# Altium project BMU_v50.PrjPcb (part 1 of 5)
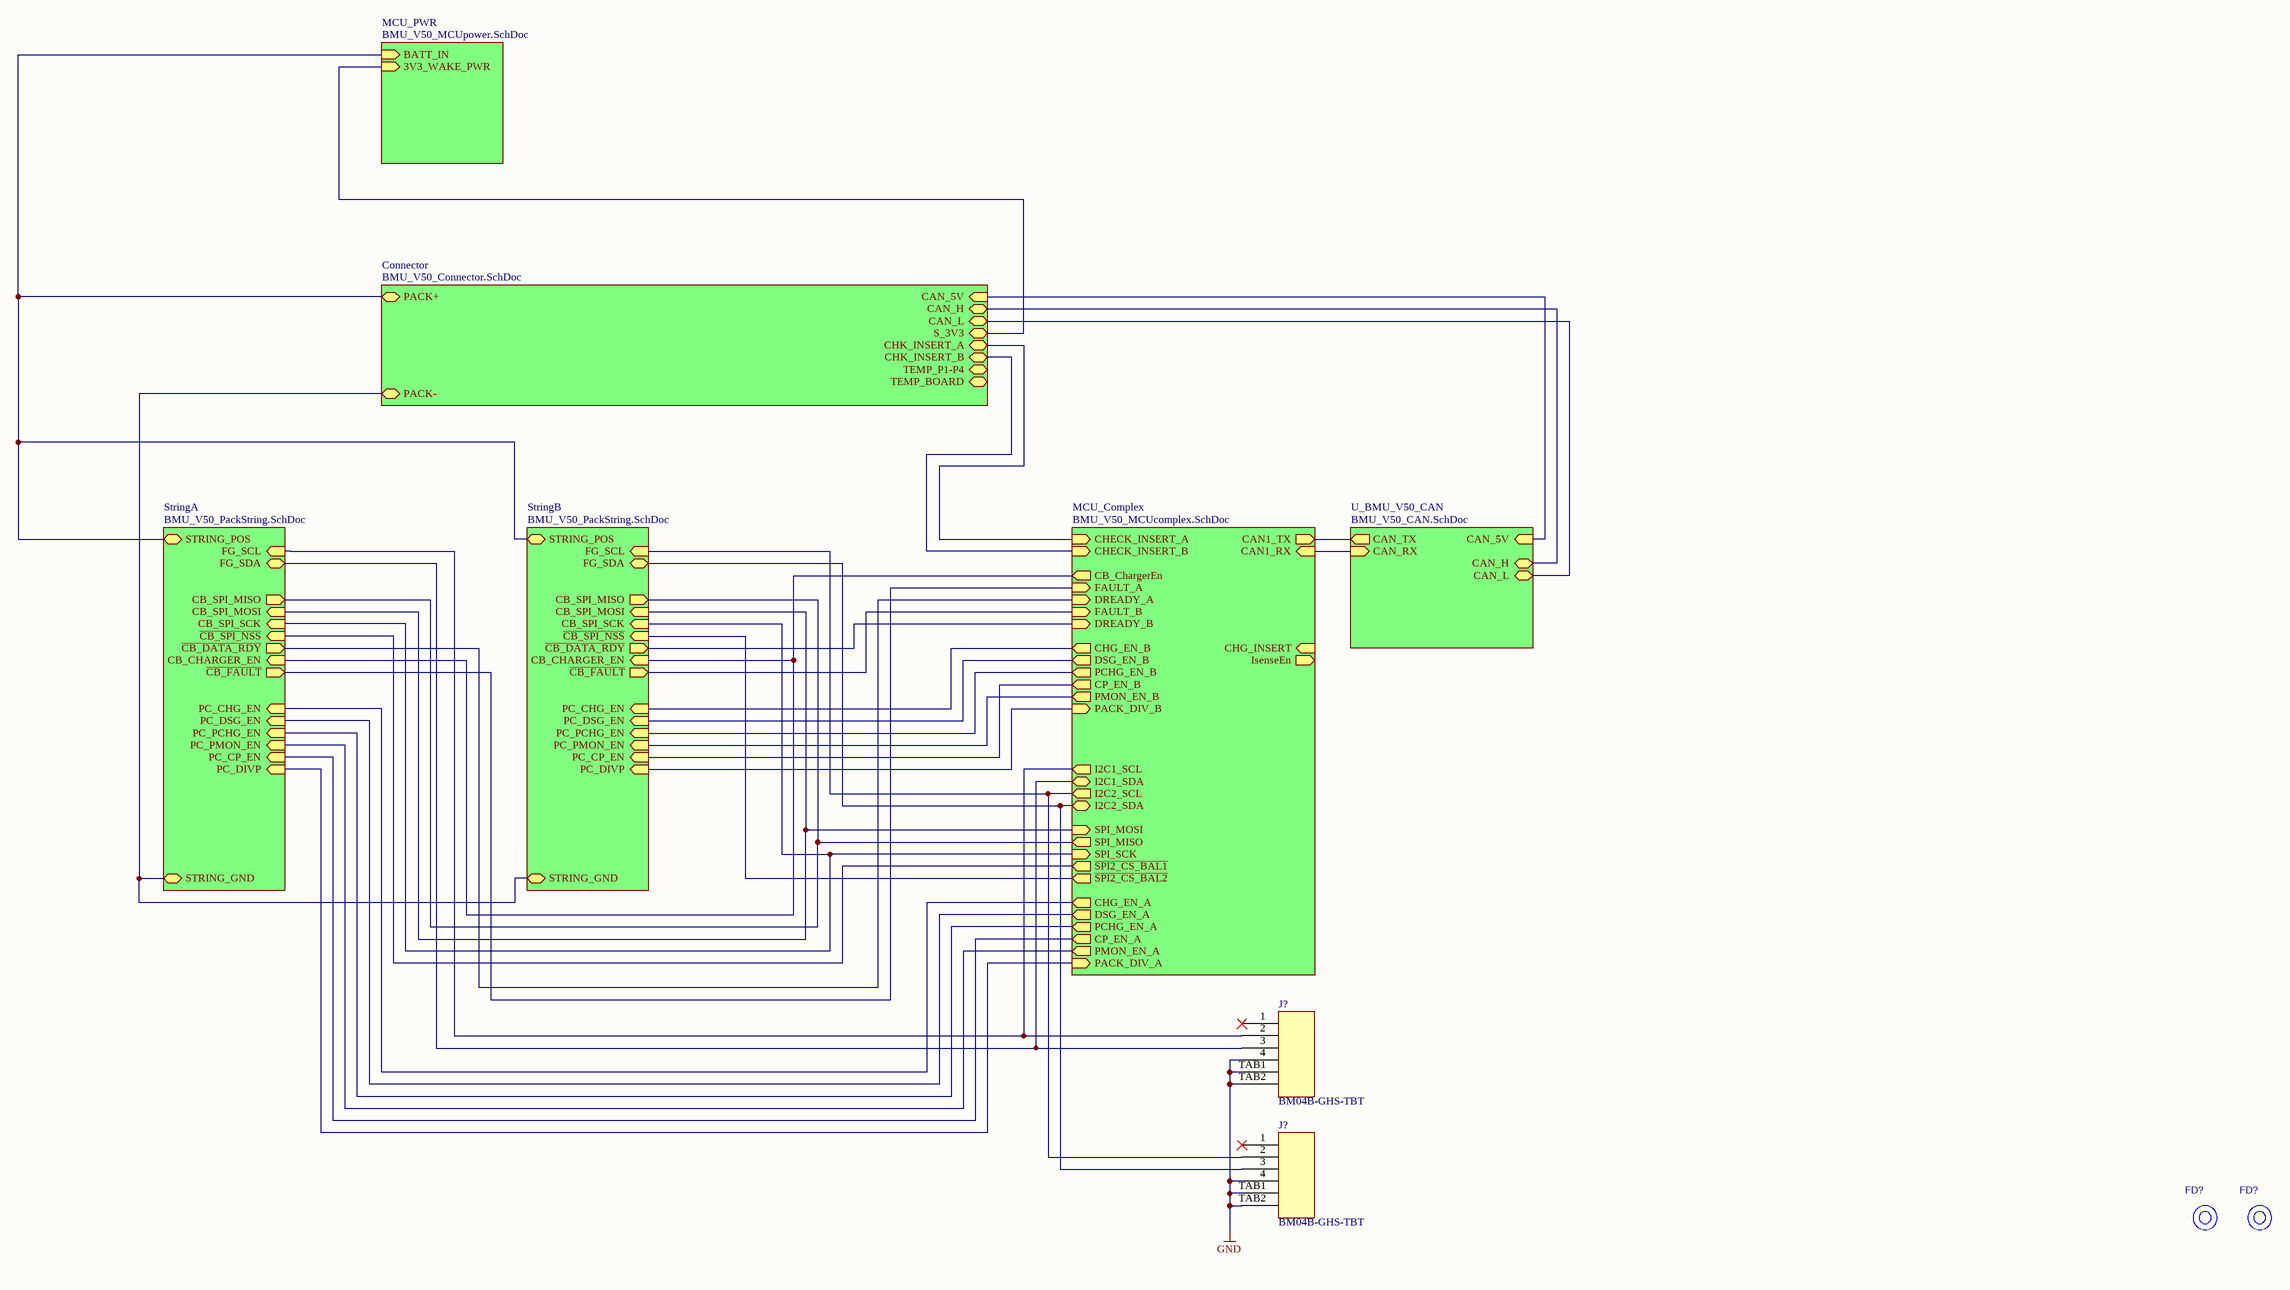
[diagram p0: BMU_V50_BlockDiagram.SchDoc]
12 sheets, 501 parts. Net scope: hierarchical (ports join the sheet entries above them; power ports are global).
Sheets:
  BMU_V50_BlockDiagram.SchDoc
    Connector = BMU_V50_Connector.SchDoc
    StringA = BMU_V50_PackString.SchDoc
      U_BMU_V50_StringFG = BMU_V50_StringFG.SchDoc
      U_BMU_V50_CellBalancer = BMU_V50_CellBalancer.SchDoc
        U_BMU_V50_CellBalanceTaps = BMU_V50_CellBalanceTaps.SchDoc
        U_BMU_V50_CellBalanceIC = BMU_V50_CellBalanceIC.SchDoc
        EXT_MEAS1 = BMU_V50_EXT_MEAS.SchDoc
        EXT_MEAS2 = BMU_V50_EXT_MEAS.SchDoc
        EXT_MEAS3 = BMU_V50_EXT_MEAS.SchDoc
        EXT_MEAS4 = BMU_V50_EXT_MEAS.SchDoc
      U_BMU_V50_StringPWRControl = BMU_V50_StringPWRControl.SchDoc
    MCU_Complex = BMU_V50_MCUcomplex.SchDoc
    MCU_PWR = BMU_V50_MCUpower.SchDoc
    U_BMU_V50_CAN = BMU_V50_CAN.SchDoc
    StringB = BMU_V50_PackString.SchDoc
      U_BMU_V50_StringFG = BMU_V50_StringFG.SchDoc
      U_BMU_V50_CellBalancer = BMU_V50_CellBalancer.SchDoc
        U_BMU_V50_CellBalanceTaps = BMU_V50_CellBalanceTaps.SchDoc
        U_BMU_V50_CellBalanceIC = BMU_V50_CellBalanceIC.SchDoc
        EXT_MEAS1 = BMU_V50_EXT_MEAS.SchDoc
        EXT_MEAS2 = BMU_V50_EXT_MEAS.SchDoc
        EXT_MEAS3 = BMU_V50_EXT_MEAS.SchDoc
        EXT_MEAS4 = BMU_V50_EXT_MEAS.SchDoc
      U_BMU_V50_StringPWRControl = BMU_V50_StringPWRControl.SchDoc

## Sheet BMU_V50_BlockDiagram.SchDoc
size C

### Parts
(Parts that share a designator on the sheet are numbered #1, #2 ... from top to bottom, then left to right.)
FD?#1  FIDUCIAL_REF  [FIDUCIAL_REFDES]  (value not drawn)  (no BOM)
FD?#2  FIDUCIAL_REF  [FIDUCIAL_REFDES]  (value not drawn)  (no BOM)
J?#1  BM04B-GHS-TBT  [BM04B-GHS-TBT]
J?#2  BM04B-GHS-TBT  [BM04B-GHS-TBT]

### Sub-sheets
Connector = BMU_V50_Connector.SchDoc: TEMP_P1-P4 (bidir), S_3V3 (bidir), CHK_INSERT_B (bidir), TEMP_BOARD (bidir), CHK_INSERT_A (bidir), PACK+ (bidir), CAN_5V (in), PACK- (bidir), CAN_H (bidir), CAN_L (bidir)
MCU_Complex = BMU_V50_MCUcomplex.SchDoc: CHG_INSERT (in), CHG_EN_A (out), ~{SPI2_CS_BAL1} (out), ~{SPI2_CS_BAL2} (out), I2C2_SCL (out), CAN1_RX (in), CAN1_TX (out), CB_ChargerEn (out), FAULT_A (in), I2C1_SDA (bidir), DREADY_A (in), SPI_SCK (in), IsenseEn (out), I2C1_SCL (out), SPI_MOSI (in), SPI_MISO (out), CHECK_INSERT_A (in), I2C2_SDA (bidir), CHECK_INSERT_B (in), FAULT_B (in), DREADY_B (in), DSG_EN_A (out), DSG_EN_B (out), CHG_EN_B (out), PACK_DIV_A (in), PACK_DIV_B (in), PMON_EN_A (out), PMON_EN_B (out), PCHG_EN_A (out), PCHG_EN_B (out), CP_EN_A (out), CP_EN_B (out)
MCU_PWR = BMU_V50_MCUpower.SchDoc: BATT_IN (in), 3V3_WAKE_PWR (in)
StringA = BMU_V50_PackString.SchDoc: FG_SDA (bidir), ~{CB_SPI_NSS} (in), ~{CB_DATA_RDY} (out), CB_CHARGER_EN (in), PC_CHG_EN (in), PC_CP_EN (in), STRING_GND (bidir), STRING_POS (bidir), FG_SCL (in), CB_SPI_MISO (out), CB_SPI_SCK (in), PC_PMON_EN (in), PC_PCHG_EN (in), PC_DSG_EN (in), CB_SPI_MOSI (in), PC_DIVP (in), ~{CB_FAULT} (out)
StringB = BMU_V50_PackString.SchDoc: FG_SDA (bidir), ~{CB_SPI_NSS} (in), ~{CB_DATA_RDY} (out), CB_CHARGER_EN (in), PC_CHG_EN (in), PC_CP_EN (in), STRING_GND (bidir), STRING_POS (bidir), FG_SCL (in), CB_SPI_MISO (out), CB_SPI_SCK (in), PC_PMON_EN (in), PC_PCHG_EN (in), PC_DSG_EN (in), CB_SPI_MOSI (in), PC_DIVP (in), ~{CB_FAULT} (out)
U_BMU_V50_CAN = BMU_V50_CAN.SchDoc: CAN_TX (out), CAN_RX (in), CAN_5V (in), CAN_H (bidir), CAN_L (bidir)

### Nets
GND: J?#1.4 J?#1.TAB1 J?#1.TAB2 J?#2.4 J?#2.TAB1 J?#2.TAB2
CAN1_RX: sheet MCU_Complex/CAN1_RX, sheet U_BMU_V50_CAN/CAN_RX
CAN1_TX: sheet MCU_Complex/CAN1_TX, sheet U_BMU_V50_CAN/CAN_TX
CAN_H: sheet Connector/CAN_H, sheet U_BMU_V50_CAN/CAN_H
CAN_L: sheet Connector/CAN_L, sheet U_BMU_V50_CAN/CAN_L
CHECK_INSERT_B: sheet Connector/CHK_INSERT_B, sheet MCU_Complex/CHECK_INSERT_B
I2C1_SCL: J?#1.2 ; sheet StringA/FG_SCL, sheet MCU_Complex/I2C1_SCL
I2C1_SDA: J?#1.3 ; sheet StringA/FG_SDA, sheet MCU_Complex/I2C1_SDA
I2C2_SCL: J?#2.2 ; sheet MCU_Complex/I2C2_SCL, sheet StringB/FG_SCL
I2C2_SDA: J?#2.3 ; sheet MCU_Complex/I2C2_SDA, sheet StringB/FG_SDA
~{SPI_CS_BAL1}: sheet StringA/~{CB_SPI_NSS}, sheet MCU_Complex/~{SPI2_CS_BAL1}
~{SPI_CS_BAL2}: sheet MCU_Complex/~{SPI2_CS_BAL2}, sheet StringB/~{CB_SPI_NSS}
SPI_MISO: sheet StringA/CB_SPI_MISO, sheet MCU_Complex/SPI_MISO, sheet StringB/CB_SPI_MISO
SPI_MOSI: sheet StringA/CB_SPI_MOSI, sheet MCU_Complex/SPI_MOSI, sheet StringB/CB_SPI_MOSI
SPI_SCK: sheet StringA/CB_SPI_SCK, sheet MCU_Complex/SPI_SCK, sheet StringB/CB_SPI_SCK
NetC?#18_1: sheet Connector/CAN_5V, sheet U_BMU_V50_CAN/CAN_5V
NetC?_StringA_U_BMU_V50_StringPWRControl#2_2: sheet Connector/PACK+, sheet StringA/STRING_POS, sheet MCU_PWR/BATT_IN, sheet StringB/STRING_POS
NetD?#4_2: sheet StringA/~{CB_FAULT}, sheet MCU_Complex/FAULT_A
NetD?#5_2: sheet MCU_Complex/FAULT_B, sheet StringB/~{CB_FAULT}
NetD?#6_2: sheet Connector/S_3V3, sheet MCU_PWR/3V3_WAKE_PWR
NetJ?#3_4: sheet Connector/CHK_INSERT_A, sheet MCU_Complex/CHECK_INSERT_A
NetJ?#3_P1: sheet Connector/PACK-, sheet StringA/STRING_GND, sheet StringB/STRING_GND
NetR?_StringA_U_BMU_V50_StringPWRControl#12_1: sheet StringA/PC_DIVP, sheet MCU_Complex/PACK_DIV_A
NetR?_StringB_U_BMU_V50_StringPWRControl#12_1: sheet MCU_Complex/PACK_DIV_B, sheet StringB/PC_DIVP
NetU?#1_8: sheet StringA/PC_DSG_EN, sheet MCU_Complex/DSG_EN_A
NetU?#1_9: sheet MCU_Complex/DSG_EN_B, sheet StringB/PC_DSG_EN
NetU?#1_10: sheet MCU_Complex/CHG_EN_B, sheet StringB/PC_CHG_EN
NetU?#1_17: sheet StringA/PC_PMON_EN, sheet MCU_Complex/PMON_EN_A
NetU?#1_24: sheet StringA/PC_CHG_EN, sheet MCU_Complex/CHG_EN_A
NetU?#1_25: sheet StringA/~{CB_DATA_RDY}, sheet MCU_Complex/DREADY_A
NetU?#1_26: sheet MCU_Complex/CP_EN_B, sheet StringB/PC_CP_EN
NetU?#1_29: sheet MCU_Complex/PCHG_EN_B, sheet StringB/PC_PCHG_EN
NetU?#1_33: sheet StringA/PC_CP_EN, sheet MCU_Complex/CP_EN_A
NetU?#1_37: sheet MCU_Complex/DREADY_B, sheet StringB/~{CB_DATA_RDY}
NetU?#1_41: sheet MCU_Complex/PMON_EN_B, sheet StringB/PC_PMON_EN
NetU?#1_50: sheet StringA/PC_PCHG_EN, sheet MCU_Complex/PCHG_EN_A
NetU?#1_55: sheet StringA/CB_CHARGER_EN, sheet MCU_Complex/CB_ChargerEn, sheet StringB/CB_CHARGER_EN

Not connected (* = marked no-connect by the designer): FD?#1 1; FD?#2 1; J?#1 1*; J?#2 1*

### Notes on the sheet
- Title
- MATTERNET
- PROPRIETRY & CONFIDENTIAL
  THE INFORMATION CONTAINS IN THIS DRAWING
  IS THE SOLE PROPERTY OF  MATTERNET Inc.
  ANY REPRODUCTION IN PART OR AS WHOLE
  WITHOUT A WRITTEN PERMISSION OF
  MATTERNET Inc. IS PROHIBITED
- Size:
- Date:
- File:
- C
- Number:
- Time:
- Revision:
- Sheet
- of
- 161 E. Evelyn Ave.
- Mountain View,
- CA 94041 USA

### Library data of the parts
FD?#1 FD?#2 = FIDUCIAL_REF: Option: AB
J?#1 J?#2 = BM04B-GHS-TBT: CONN HEADER GH TOP 4POS 1.25MM; System: Connector; ComponentLink1Description: JST GH Series Datasheet; ComponentLink1URL: http://www.jst-mfg.com/product/pdf/eng/eGH.pdf; Supplier 2: Digi-Key; Supplier Part Number 2: 455-1580-1-ND; Supplier 1: Heilind Electronics; Supplier Part Number 1: JSTBM04B-GHS-TBT(LF)(SN)N

## Sheet BMU_V50_Connector.SchDoc
size C
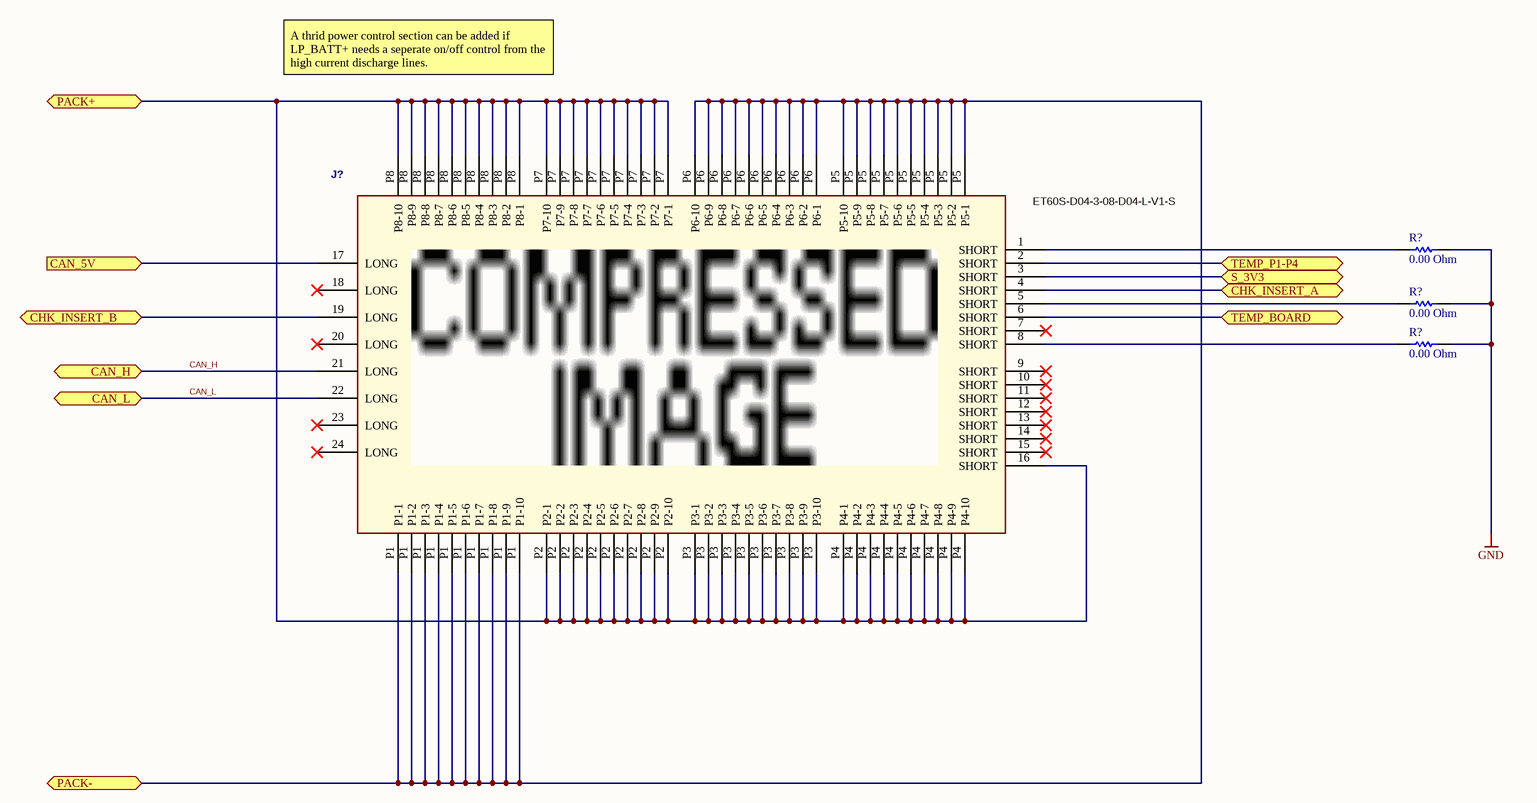
[diagram p1: BMU_V50_Connector.SchDoc]

### Parts
(Parts that share a designator on the sheet are numbered #1, #2 ... from top to bottom, then left to right.)
J?#3  ET60S-D04-3-08-D04-L-V1-S  [ET60S-D04-3-08-D04-L-V1-S]
R?#1  value 0.00 Ohm  [RESC0402(1005)_L]  (hidden comment: Jumper 0402(1005))
R?#2  value 0.00 Ohm  [RESC0402(1005)_L]  (hidden comment: Jumper 0402(1005))
R?#3  value 0.00 Ohm  [RESC0402(1005)_L]  (hidden comment: Jumper 0402(1005))

### Ports
CAN_5V (in), CAN_H (bidir), CAN_L (bidir), CHK_INSERT_A (bidir), CHK_INSERT_B (bidir), PACK+ (bidir), PACK- (bidir), S_3V3 (bidir), TEMP_BOARD (bidir), TEMP_P1-P4 (bidir)

### Nets
GND: R?#1.1 R?#2.1 R?#3.2
CAN_H: J?#3.21(LONG) ; port CAN_H
CAN_L: J?#3.22(LONG) ; port CAN_L
CHECK_INSERT_B: J?#3.19(LONG) ; port CHK_INSERT_B
NetC?#18_1: J?#3.17(LONG) ; port CAN_5V
NetC?_StringA_U_BMU_V50_StringPWRControl#2_2: J?#3.16(SHORT) J?#3.P2(P2-1) J?#3.P3(P3-1) J?#3.P4(P4-1) J?#3.P7(P7-1) J?#3.P8(P8-1) ; port PACK+
NetD?#6_2: J?#3.3(SHORT) ; port S_3V3
NetJ?#3_1: J?#3.1(SHORT) R?#1.2
NetJ?#3_2: J?#3.2(SHORT) ; port TEMP_P1-P4
NetJ?#3_4: J?#3.4(SHORT) ; port CHK_INSERT_A
NetJ?#3_5: J?#3.5(SHORT) R?#2.2
NetJ?#3_6: J?#3.6(SHORT) ; port TEMP_BOARD
NetJ?#3_8: J?#3.8(SHORT) R?#3.1
NetJ?#3_P1: J?#3.P1(P1-1) J?#3.P5(P5-1) J?#3.P6(P6-1) ; port PACK-

Not connected (* = marked no-connect by the designer): J?#3 7(SHORT)* 9(SHORT)* 10(SHORT)* 11(SHORT)* 12(SHORT)* 13(SHORT)* 14(SHORT)* 15(SHORT)* 18(LONG)* 20(LONG)* 23(LONG)* 24(LONG)*

### Notes on the sheet
- A thrid power control section can be added if LP_BATT+ needs a seperate on/off control from the high current discharge lines.
- Title
- MATTERNET
- PROPRIETRY & CONFIDENTIAL
  THE INFORMATION CONTAINS IN THIS DRAWING
  IS THE SOLE PROPERTY OF  MATTERNET Inc.
  ANY REPRODUCTION IN PART OR AS WHOLE
  WITHOUT A WRITTEN PERMISSION OF
  MATTERNET Inc. IS PROHIBITED
- Size:
- Date:
- File:
- C
- Number:
- Time:
- Revision:
- Sheet
- of
- 161 E. Evelyn Ave.
- Mountain View,
- CA 94041 USA

### Library data of the parts
J?#3 = ET60S-D04-3-08-D04-L-V1-S: EXtreme Ten60 Power Connector; custinv: Samtec; custprt: ET60S-D04-3-08-D04-L-V1-S; Supplier 1: Mouser; Supplier Part Number 1: 200-60SD04308D04LV1S; Manufacturer: Samtec; Manufacturer Part Number: ET60S-D04-3-08-D04-L-V1-S; Stock 1: 0; Pricing 1: 1=7.94, 10=7.35, 50=6.59, 100=6.15, 1000=4.96, 10000=4.96 (USD); Supplier 2: Farnell; Supplier Part Number 2: 2731048; Stock 2: 0
R?#1-R?#3 = CMP-1011-00001-1: Jumper 0402 (1005 Metric); Tolerance: None; Case-Metric: 1005; Case-EIA: 0402; Power: None; Technology: SMT

## Sheet BMU_V50_PackString.SchDoc
size C
Used 2 times, as channels StringA, StringB. Parts and nets are listed once, with the designators drawn on the sheet.
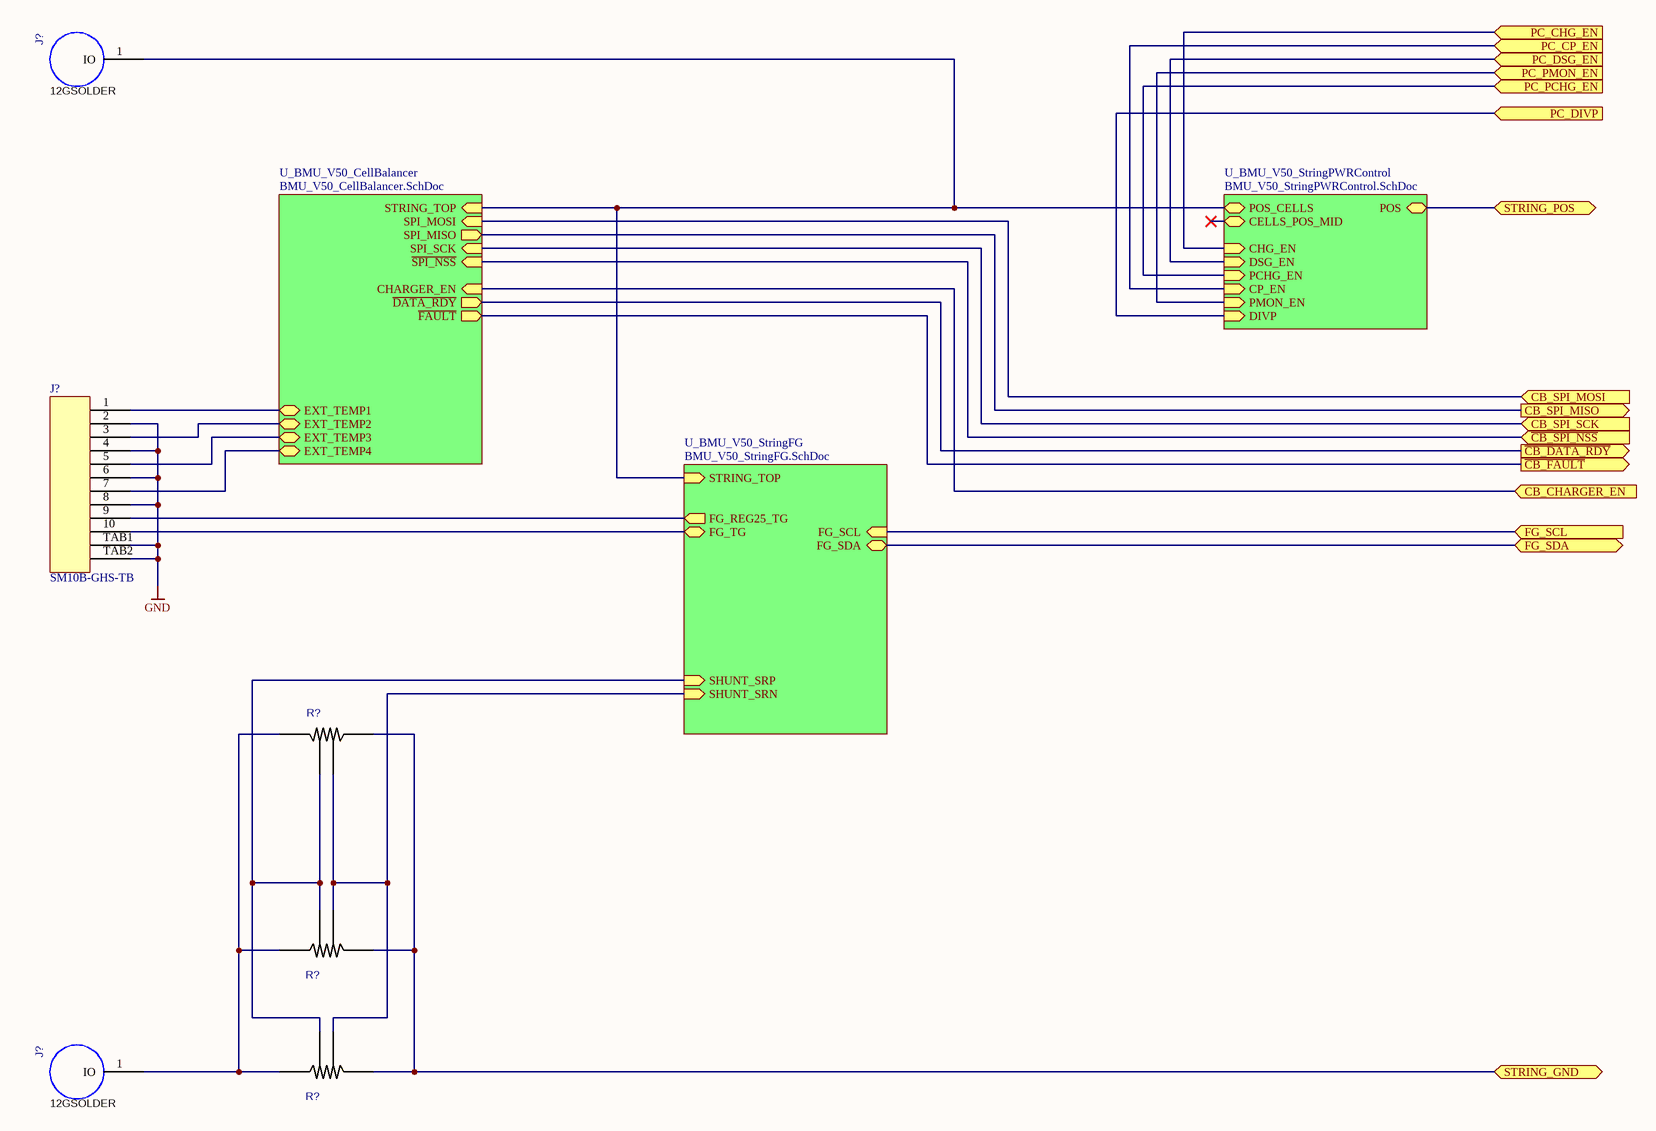
[diagram p2: BMU_V50_PackString.SchDoc]

### Parts
(Parts that share a designator on the sheet are numbered #1, #2 ... from top to bottom, then left to right.)
J?#1  12GSOLDER  [12GPAD]  (no BOM)
J?#2  SM10B-GHS-TB  [SM10B-GHS-TB]
J?#3  12GSOLDER  [12GPAD]  (no BOM)
R?#1  WSL59313L000FEA  [R5931]  (value not drawn)
R?#2  WSL59313L000FEA  [R5931]  (value not drawn)
R?#3  WSL59313L000FEA  [R5931]  (value not drawn)

### Sub-sheets
U_BMU_V50_CellBalancer = BMU_V50_CellBalancer.SchDoc: SPI_SCK (in), ~{SPI_NSS} (in), CHARGER_EN (in), SPI_MISO (out), ~{DATA_RDY} (out), ~{FAULT} (out), SPI_MOSI (in), STRING_TOP (in), EXT_TEMP4 (bidir), EXT_TEMP1 (bidir), EXT_TEMP2 (bidir), EXT_TEMP3 (bidir)
U_BMU_V50_StringFG = BMU_V50_StringFG.SchDoc: STRING_TOP (in), FG_REG25_TG (out), FG_SCL (in), FG_SDA (bidir), SHUNT_SRP (in), SHUNT_SRN (in), FG_TG (bidir)
U_BMU_V50_StringPWRControl = BMU_V50_StringPWRControl.SchDoc: DSG_EN (in), CP_EN (in), POS_CELLS (bidir), POS (bidir), CELLS_POS_MID (bidir), PCHG_EN (in), PMON_EN (in), DIVP (in), CHG_EN (in)

### Ports
CB_CHARGER_EN (in), CB_SPI_MISO (out), CB_SPI_MOSI (in), CB_SPI_SCK (in), FG_SCL (in), FG_SDA (bidir), PC_CHG_EN (in), PC_CP_EN (in), PC_DIVP (in), PC_DSG_EN (in), PC_PCHG_EN (in), PC_PMON_EN (in), STRING_GND (bidir), STRING_POS (bidir), ~{CB_DATA_RDY} (out), ~{CB_FAULT} (out), ~{CB_SPI_NSS} (in)

### Nets
GND: J?#2.2 J?#2.4 J?#2.6 J?#2.8 J?#2.TAB1 J?#2.TAB2
~{CB_DATA_RDY}: port ~{CB_DATA_RDY}, sheet U_BMU_V50_CellBalancer/~{DATA_RDY}
~{CB_FAULT}: port ~{CB_FAULT}, sheet U_BMU_V50_CellBalancer/~{FAULT}
~{CB_SPI_NSS}: port ~{CB_SPI_NSS}, sheet U_BMU_V50_CellBalancer/~{SPI_NSS}
CB_CHARGER_EN: port CB_CHARGER_EN, sheet U_BMU_V50_CellBalancer/CHARGER_EN
CB_SPI_MISO: port CB_SPI_MISO, sheet U_BMU_V50_CellBalancer/SPI_MISO
CB_SPI_MOSI: port CB_SPI_MOSI, sheet U_BMU_V50_CellBalancer/SPI_MOSI
CB_SPI_SCK: port CB_SPI_SCK, sheet U_BMU_V50_CellBalancer/SPI_SCK
FG_SCL: port FG_SCL, sheet U_BMU_V50_StringFG/FG_SCL
FG_SDA: port FG_SDA, sheet U_BMU_V50_StringFG/FG_SDA
PC_CHG_EN: port PC_CHG_EN, sheet U_BMU_V50_StringPWRControl/CHG_EN
PC_CP_EN: port PC_CP_EN, sheet U_BMU_V50_StringPWRControl/CP_EN
PC_DIVP: port PC_DIVP, sheet U_BMU_V50_StringPWRControl/DIVP
PC_DSG_EN: port PC_DSG_EN, sheet U_BMU_V50_StringPWRControl/DSG_EN
PC_PCHG_EN: port PC_PCHG_EN, sheet U_BMU_V50_StringPWRControl/PCHG_EN
PC_PMON_EN: port PC_PMON_EN, sheet U_BMU_V50_StringPWRControl/PMON_EN
STRING_GND: R?#1.2 R?#2.1 R?#3.1 ; port STRING_GND
STRING_POS: port STRING_POS, sheet U_BMU_V50_StringPWRControl/POS
NetJ?#1_1: J?#1.1(IO) ; sheet U_BMU_V50_StringFG/STRING_TOP, sheet U_BMU_V50_CellBalancer/STRING_TOP, sheet U_BMU_V50_StringPWRControl/POS_CELLS
NetJ?#2_1: J?#2.1 ; sheet U_BMU_V50_CellBalancer/EXT_TEMP1
NetJ?#2_3: J?#2.3 ; sheet U_BMU_V50_CellBalancer/EXT_TEMP2
NetJ?#2_5: J?#2.5 ; sheet U_BMU_V50_CellBalancer/EXT_TEMP3
NetJ?#2_7: J?#2.7 ; sheet U_BMU_V50_CellBalancer/EXT_TEMP4
NetJ?#2_9: J?#2.9 ; sheet U_BMU_V50_StringFG/FG_REG25_TG
NetJ?#2_10: J?#2.10 ; sheet U_BMU_V50_StringFG/FG_TG
NetJ?#3_1: J?#3.1(IO) R?#1.1 R?#2.2 R?#3.2
NetR?#1_3: R?#1.3 R?#2.4 R?#3.4 ; sheet U_BMU_V50_StringFG/SHUNT_SRP
NetR?#1_4: R?#1.4 R?#2.3 R?#3.3 ; sheet U_BMU_V50_StringFG/SHUNT_SRN

### Channels
StringA: designators J?=J?_StringA#3 J?=J?_StringA#1 J?=J?_StringA#2 R?=R?_StringA#2 R?=R?_StringA#1 R?=R?_StringA#3; ports CB_CHARGER_EN=NetU?#1_55 CB_SPI_MISO=SPI_MISO CB_SPI_MOSI=SPI_MOSI CB_SPI_SCK=SPI_SCK FG_SCL=I2C1_SCL FG_SDA=I2C1_SDA PC_CHG_EN=NetU?#1_24 PC_CP_EN=NetU?#1_33 PC_DIVP=NetR?_StringA_U_BMU_V50_StringPWRControl#12_1 PC_DSG_EN=NetU?#1_8 PC_PCHG_EN=NetU?#1_50 PC_PMON_EN=NetU?#1_17 STRING_GND=NetJ?#3_P1 STRING_POS=NetC?_StringA_U_BMU_V50_StringPWRControl#2_2 ~{CB_DATA_RDY}=NetU?#1_25 ~{CB_FAULT}=NetD?#4_2 ~{CB_SPI_NSS}=~{SPI_CS_BAL1}
StringB: designators J?=J?_StringB#3 J?=J?_StringB#1 J?=J?_StringB#2 R?=R?_StringB#2 R?=R?_StringB#1 R?=R?_StringB#3; ports CB_CHARGER_EN=NetU?#1_55 CB_SPI_MISO=SPI_MISO CB_SPI_MOSI=SPI_MOSI CB_SPI_SCK=SPI_SCK FG_SCL=I2C2_SCL FG_SDA=I2C2_SDA PC_CHG_EN=NetU?#1_10 PC_CP_EN=NetU?#1_26 PC_DIVP=NetR?_StringB_U_BMU_V50_StringPWRControl#12_1 PC_DSG_EN=NetU?#1_9 PC_PCHG_EN=NetU?#1_29 PC_PMON_EN=NetU?#1_41 STRING_GND=NetJ?#3_P1 STRING_POS=NetC?_StringA_U_BMU_V50_StringPWRControl#2_2 ~{CB_DATA_RDY}=NetU?#1_37 ~{CB_FAULT}=NetD?#5_2 ~{CB_SPI_NSS}=~{SPI_CS_BAL2}

### Notes on the sheet
- Title
- MATTERNET
- PROPRIETRY & CONFIDENTIAL
  THE INFORMATION CONTAINS IN THIS DRAWING
  IS THE SOLE PROPERTY OF  MATTERNET Inc.
  ANY REPRODUCTION IN PART OR AS WHOLE
  WITHOUT A WRITTEN PERMISSION OF
  MATTERNET Inc. IS PROHIBITED
- Size:
- Date:
- File:
- C
- Number:
- Time:
- Revision:
- Sheet
- of
- 161 E. Evelyn Ave.
- Mountain View,
- CA 94041 USA

### Library data of the parts
J?#1 J?#3 = 12GSOLDER: Option: AB
J?#2 = SM10B-GHS-TB: CONN HEADER GH SIDE 10POS 1.25MM; System: Connector; ComponentLink1Description: JST GH Series Datasheet; ComponentLink1URL: http://www.jst-mfg.com/product/pdf/eng/eGH.pdf; Supplier 1: Digi-Key; Supplier Part Number 1: 455-1572-1-ND
R?#1-R?#3 = Res_4Term: RES SMD 3 MOHM 1% 5W 5931; Manufacturer 1: Vishay Dale; Resistance: 3mR; Temperature Coefficient: 75ppm/°C; Supplier 1: Digi-Key; Supplier Part Number 1: WSLN-.003CT-ND; Manufacturer Part Number 1: WSL59313L000FEA; RoHS: Yes; Category: Chip SMD Resistors; Stock 1: 2078; Pricing 1: 1=2.28000, 10=2.02300, 25=1.87600, 50=1.76560, 100=1.54490, 250=1.32424, 500=1.10354 (USD); Case/Package: 5931; Case Code (Imperial): 5931; Min Operating Temperature: -65°C; Max Operating Temperature: 170°C; Composition: Metal Element,Metal Strip; Number of Terminations: 2; Termination: SMD/SMT; Features: Moisture Resistant; Package Quantity: 1; Power Rating: 5W; Tolerance: 1%; Packaging: Tape and Reel; Max Power Dissipation: 5W; Length: 0.591inch; Height: 0.02inch; Width: 0.305inch
  R?#1: ComponentLink1URL: https://datasheet.ciiva.com/2484/wsl3921-2484790.pdf?src-supplier=Digi-Key; ComponentLink1Description: https://datasheet.ciiva.com/2484/wsl3921-2484790.pdf?src-supplier=Digi-Key; ComponentLink2URL: https://datasheet.ciiva.com/2484/wsl3921-2484791.pdf?src-supplier=Digi-Key; ComponentLink2Description: https://datasheet.ciiva.com/2484/wsl3921-2484791.pdf?src-supplier=Digi-Key; ComponentLink3URL: https://datasheet.ciiva.com/2484/wsl3921-2484792.pdf?src-supplier=Digi-Key; ComponentLink3Description: https://datasheet.ciiva.com/2484/wsl3921-2484792.pdf?src-supplier=Digi-Key
  R?#2 R?#3: ComponentLink1URL: http://www.farnell.com/datasheets/1678796.pdf; ComponentLink1Description: http://www.farnell.com/datasheets/1678796.pdf; ComponentLink2URL: http://industrial.panasonic.com/www-data/pdf/AOA0000/AOA0000CE1.pdf; ComponentLink2Description: http://industrial.panasonic.com/www-data/pdf/AOA0000/AOA0000CE1.pdf; ComponentLink3URL: http://www.mouser.com/ds/2/315/AOA0000C84-947596.pdf; ComponentLink3Description: http://www.mouser.com/ds/2/315/AOA0000C84-947596.pdf; ComponentLink4URL: https://www.alliedelec.com/m/d/51cd0790071e1666bdb9d00c57fcf960.pdf; ComponentLink4Description: https://www.alliedelec.com/m/d/51cd0790071e1666bdb9d00c57fcf960.pdf; ComponentLink5URL: http://www.vishay.com/docs/30110/wsl3921.pdf; ComponentLink5Description: http://www.vishay.com/docs/30110/wsl3921.pdf; ComponentLink6URL: https://datasheet.ciiva.com/2484/wsl3921-2484790.pdf?src-supplier=Digi-Key; ComponentLink6Description: https://datasheet.ciiva.com/2484/wsl3921-2484790.pdf?src-supplier=Digi-Key; ComponentLink7URL: https://datasheet.ciiva.com/2484/wsl3921-2484791.pdf?src-supplier=Digi-Key; ComponentLink7Description: https://datasheet.ciiva.com/2484/wsl3921-2484791.pdf?src-supplier=Digi-Key; ComponentLink8URL: https://datasheet.ciiva.com/2484/wsl3921-2484792.pdf?src-supplier=Digi-Key; ComponentLink8Description: https://datasheet.ciiva.com/2484/wsl3921-2484792.pdf?src-supplier=Digi-Key

## Sheet BMU_V50_StringFG.SchDoc
size C
Used 2 times, as channels StringA/U_BMU_V50_StringFG, StringB/U_BMU_V50_StringFG. Parts and nets are listed once, with the designators drawn on the sheet.
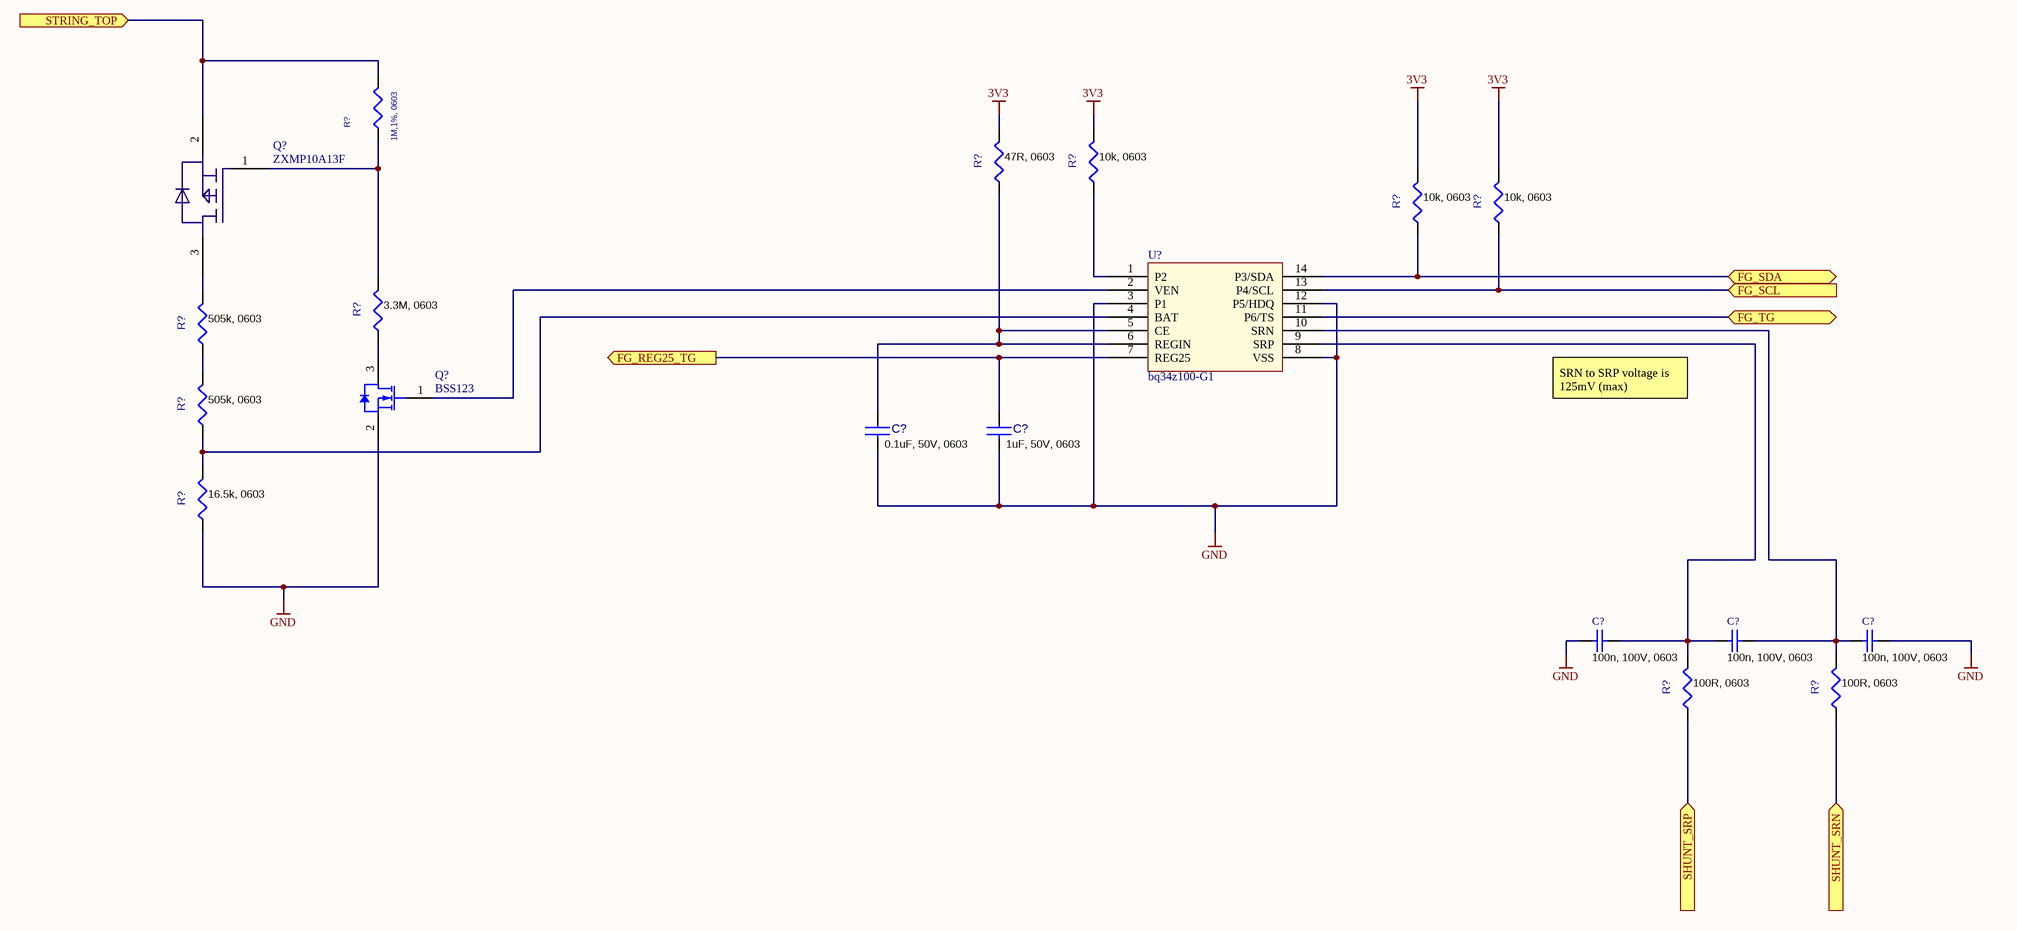
[diagram p3: BMU_V50_StringFG.SchDoc]

### Parts
(Parts that share a designator on the sheet are numbered #1, #2 ... from top to bottom, then left to right.)
C?#1  0.1uF, 50V, 0603  [C0603]
C?#2  1uF, 50V, 0603  [C0603]
C?#3  100n, 100V, 0603  [C0603]
C?#4  100n, 100V, 0603  [C0603]
C?#5  100n, 100V, 0603  [C0603]
Q?#1  ZXMP10A13F  [SOT90P240X110-3N - ZXMP10A13F]
Q?#2  BSS123  [FAIR-SOT23-3_V]
R?#1  1M,1%, 0603  [R0603]
R?#2  47R, 0603  [R0603]
R?#3  10k, 0603  [R0603]
R?#4  10k, 0603  [R0603]
R?#5  10k, 0603  [R0603]
R?#6  3.3M, 0603  [R0603]
R?#7  505k, 0603  [R0603]
R?#8  505k, 0603  [R0603]
R?#9  16.5k, 0603  [R0603]
R?#10  100R, 0603  [R0603]
R?#11  100R, 0603  [R0603]
U?  bq34z100-G1  [PW14]

### Ports
FG_REG25_TG (out), FG_SCL (in), FG_SDA (bidir), FG_TG (bidir), SHUNT_SRN (in), SHUNT_SRP (in), STRING_TOP (in)

### Nets
3V3: R?#2.2 R?#3.2 R?#4.2 R?#5.2
GND: C?#1.2 C?#2.2 C?#3.2 C?#5.1 Q?#2.2(S) R?#9.1 U?.3(P1) U?.8(VSS) U?.12(P5/HDQ)
FG_REG25_TG: C?#2.1 U?.7(REG25) ; port FG_REG25_TG
FG_SCL: R?#5.1 U?.13(P4/SCL) ; port FG_SCL
FG_SDA: R?#4.1 U?.14(P3/SDA) ; port FG_SDA
FG_TG: U?.11(P6/TS) ; port FG_TG
SHUNT_SRN: R?#11.1 ; port SHUNT_SRN
SHUNT_SRP: R?#10.1 ; port SHUNT_SRP
STRING_TOP: Q?#1.2(S) R?#1.2 ; port STRING_TOP
NetC?#1_1: C?#1.1 R?#2.1 U?.5(CE) U?.6(REGIN)
NetC?#3_1: C?#3.1 C?#4.2 R?#10.2 U?.9(SRP)
NetC?#4_1: C?#4.1 C?#5.2 R?#11.2 U?.10(SRN)
NetQ?#1_1: Q?#1.1(G) R?#1.1 R?#6.2
NetQ?#1_3: Q?#1.3(D) R?#7.2
NetQ?#2_1: Q?#2.1(G) U?.2(VEN)
NetQ?#2_3: Q?#2.3(D) R?#6.1
NetR?#3_1: R?#3.1 U?.1(P2)
NetR?#7_1: R?#7.1 R?#8.2
NetR?#8_1: R?#8.1 R?#9.2 U?.4(BAT)

### Channels
StringA/U_BMU_V50_StringFG: designators C?=C?_StringA_U_BMU_V50_StringFG#1 C?=C?_StringA_U_BMU_V50_StringFG#2 C?=C?_StringA_U_BMU_V50_StringFG#3 C?=C?_StringA_U_BMU_V50_StringFG#4 C?=C?_StringA_U_BMU_V50_StringFG#5 Q?=Q?_StringA_U_BMU_V50_StringFG#1 Q?=Q?_StringA_U_BMU_V50_StringFG#2 R?=R?_StringA_U_BMU_V50_StringFG#3 R?=R?_StringA_U_BMU_V50_StringFG#2 R?=R?_StringA_U_BMU_V50_StringFG#1 R?=R?_StringA_U_BMU_V50_StringFG#8 R?=R?_StringA_U_BMU_V50_StringFG#9 R?=R?_StringA_U_BMU_V50_StringFG#7 R?=R?_StringA_U_BMU_V50_StringFG#6 R?=R?_StringA_U_BMU_V50_StringFG#4 R?=R?_StringA_U_BMU_V50_StringFG#5 R?=R?_StringA_U_BMU_V50_StringFG#10 R?=R?_StringA_U_BMU_V50_StringFG#11 U?=U?_StringA_U_BMU_V50_StringFG; ports FG_REG25_TG=NetC?_StringA_U_BMU_V50_StringFG#2_1 FG_SCL=I2C1_SCL FG_SDA=I2C1_SDA FG_TG=NetJ?_StringA#2_10 SHUNT_SRN=NetR?_StringA#1_4 SHUNT_SRP=NetR?_StringA#1_3 STRING_TOP=NetC?_StringA_U_BMU_V50_StringPWRControl#1_1
StringB/U_BMU_V50_StringFG: designators C?=C?_StringB_U_BMU_V50_StringFG#1 C?=C?_StringB_U_BMU_V50_StringFG#2 C?=C?_StringB_U_BMU_V50_StringFG#3 C?=C?_StringB_U_BMU_V50_StringFG#4 C?=C?_StringB_U_BMU_V50_StringFG#5 Q?=Q?_StringB_U_BMU_V50_StringFG#1 Q?=Q?_StringB_U_BMU_V50_StringFG#2 R?=R?_StringB_U_BMU_V50_StringFG#3 R?=R?_StringB_U_BMU_V50_StringFG#2 R?=R?_StringB_U_BMU_V50_StringFG#1 R?=R?_StringB_U_BMU_V50_StringFG#8 R?=R?_StringB_U_BMU_V50_StringFG#9 R?=R?_StringB_U_BMU_V50_StringFG#7 R?=R?_StringB_U_BMU_V50_StringFG#6 R?=R?_StringB_U_BMU_V50_StringFG#4 R?=R?_StringB_U_BMU_V50_StringFG#5 R?=R?_StringB_U_BMU_V50_StringFG#10 R?=R?_StringB_U_BMU_V50_StringFG#11 U?=U?_StringB_U_BMU_V50_StringFG; ports FG_REG25_TG=NetC?_StringB_U_BMU_V50_StringFG#2_1 FG_SCL=I2C2_SCL FG_SDA=I2C2_SDA FG_TG=NetJ?_StringB#2_10 SHUNT_SRN=NetR?_StringB#1_4 SHUNT_SRP=NetR?_StringB#1_3 STRING_TOP=NetC?_StringB_U_BMU_V50_StringPWRControl#1_1

### Notes on the sheet
- SRN to SRP voltage is 125mV (max)
- Title
- MATTERNET
- PROPRIETRY & CONFIDENTIAL
  THE INFORMATION CONTAINS IN THIS DRAWING
  IS THE SOLE PROPERTY OF  MATTERNET Inc.
  ANY REPRODUCTION IN PART OR AS WHOLE
  WITHOUT A WRITTEN PERMISSION OF
  MATTERNET Inc. IS PROHIBITED
- Size:
- Date:
- File:
- C
- Number:
- Time:
- Revision:
- Sheet
- of
- 161 E. Evelyn Ave.
- Mountain View,
- CA 94041 USA

### Library data of the parts
C?#1 = CAP-Generic-0603: CAP CER 0.1UF 50V 10% X7R 0603; Manufacturer: Murata; Manufacturer Part Number: GCJ188R71E104KA12D; Supplier 1: Digi-Key; Supplier Part Number 1: 490-16477-1-ND; Stock 1: 2560; Pricing 1: 1=0.22, 10=0.152, 100=0.077, 500=0.0527, 1000=0.04662 (USD); Case/Package: 0603; Supplier 2: Mouser; Supplier Part Number 2: 81-GCJ188R71E104KA2D; Stock 2: 47905; Pricing 2: 1=0.21, 10=0.139, 50=0.139, 100=0.071, 1000=0.043, 10000=0.035 (USD)
C?#2 = CAP-Generic-0603: CAP CER 1UF 50V 10% X7R 0603
C?#3-C?#5 = Cap: CAP CER 100n 100V X7R 0603; Manufacturer: Murata; Manufacturer Part Number: GCJ188R72A104KA01D; Capacitance: 100nF; Tolerance: 10%; Supplier 1: Digi-Key; Supplier Part Number 1: 490-13420-1-ND; Stock 1: 224293; Pricing 1: 1=0.28, 10=0.189, 100=0.1073, 500=0.07578, 1000=0.0663 (USD); Mount: Surface Mount; Case/Package: 0603; Case Code (Metric): 1608; Case Code (Imperial): 0603; Min Operating Temperature: -55°C; Max Operating Temperature: 125°C; Packaging: Tape and Reel; Voltage Rating: 100V; Features: Soft Termination; Length: 0.063inch; Width: 0.031inch; Thickness: 0.035inch; Ratings: AEC-Q200; Lead Free: Lead Free; Supplier 2: Mouser; Supplier Part Number 2: 81-GCJ188R72A104KA1D; Stock 2: 680575; Pricing 2: 1=0.26, 10=0.173, 50=0.173, 100=0.099, 1000=0.061, 10000=0.05 (USD)
Q?#1 = ZXMP10A13F: 100V P-CHANNEL ENHANCEMENT MODE MOSFET; Supplier 1: Digi-Key; ComponentLink1Description: Datasheet; ComponentLink1URL: https://www.diodes.com/assets/Datasheets/ZXMP10A13F.pdf; Supplier Part Number 1: ZXMP10A13FCT-ND
Q?#2 = CMP-2000-04934-1: N-Channel Logic Level Enhancement Mode Field Effect Transistor, 1.7 V, -55 to 150 degC, 3-Pin SOT-23, RoHS, Tape and Reel; Manufacturer: Fairchild; Channel Type: N; Typical Turn-Off Delay Time: 17ns; Maximum Continuous Drain Current: 0.17A; Rad Hard: No; Typical Rise Time: 9ns; Typical Fall Time: 2.4ns; Maximum Gate Source Voltage: ±20V; Maximum Drain Source Voltage: 100V; Typical Turn-On Delay Time: 1.7ns; RDS-on: 6000@10VmOhm; Package Version: Rev. 12, 03/2016; Packaging: Tape&Reel; Package Reference: SOT23-3; Channel Mode: Enhancement; Operating Temperature: -55to150degC; Package Description: 3-Pin Small Outline Transistor, Body 2.92 x 1.325 mm, Pitch 0.95 mm; Category: MOSFET; Datasheet Version: Jun-03; Datasheet URL: https://www.fairchildsemi.com/datasheets/BS/BSS123.pdf; Manufacturer URL: https://www.fairchildsemi.com/; Mounting: SurfaceMount; Package: 3SOT-23; Package URL: http://www.fairchildsemi.com/dwg/MA/MA03D.pdf
R?#1 = R-Generic-0603: custprt: 100-0110-000153; custinv: Ansync; Option: AB
R?#2 = R-Generic-0603: RES SMD 47R OHM 1% 1/10W 0603
R?#3-R?#5 = R-Generic-0603: RES SMD 10k OHM 1% 1/10W 0603
R?#6 = R-Generic-0603: RES SMD 3.3M OHM 1% 1/10W 0603
R?#7 R?#8 = R-Generic-0603: RES SMD 505k OHM 1% 1/10W 0603
R?#9 = R-Generic-0603: RES SMD 16.5k OHM 1% 1/10W 0603
R?#10 R?#11 = R-Generic-0603: RES SMD 100R OHM 1% 1/10W 0603
U? = bq34z100-G1: Wide Range Fuel Gauge with Impedance Track™ Technology; Manufacturer 1: Texas Instruments; Manufacturer Part Number 1: BQ34Z100PWR-G1; Operating Supply Voltage: 4.5V; Interface: I2C; Supplier 1: Digi-Key; RoHS: Yes; Category: Battery Management; Stock 1: 18187; Pricing 1: 1=4.08000, 10=3.66500, 25=3.46520, 100=2.84900, 250=2.55640, 500=2.46400, 1000=2.04820 (USD); Mount: Surface Mount; Case/Package: TSSOP; Number of Pins: 14; Weight: 0.004949oz; Contact Plating: Gold; Min Operating Temperature: -40°C; Max Operating Temperature: 85°C; Package Quantity: 2000; Packaging: Tape and Reel; Lead Free: Lead Free; ComponentLink1URL: http://www.ti.com/lit/ds/symlink/bq34z100-g1.pdf?src-supplier=Digi-Key; ComponentLink1Description: http://www.ti.com/lit/ds/symlink/bq34z100-g1.pdf?src-supplier=Digi-Key; ComponentLink2URL: http://www.ti.com/general/docs/lit/getliterature.tsp?genericPartNumber=BQ34Z100-G1&&fileType=pdf&src-supplier=Avnet; ComponentLink2Description: http://www.ti.com/general/docs/lit/getliterature.tsp?genericPartNumber=BQ34Z100-G1&&fileType=pdf&src-supplier=Avnet; ComponentLink3URL: http://www.ti.com/lit/gpn/bq34z100-g1?src-supplier=Mouser; ComponentLink3Description: http://www.ti.com/lit/gpn/bq34z100-g1?src-supplier=Mouser; Supplier 2: Mouser; Manufacturer 2: Texas Instruments; Manufacturer Part Number 2: BQ34Z100PWR-G1; Stock 2: 14027; Pricing 2: 1=4.09000, 10=3.67000, 25=3.47000, 100=2.85000, 250=2.56000, 500=2.47000 (USD); Supplier Part Number 1: 296-39949-1-ND; Supplier Part Number 2: 595-BQ34Z100PWR-G1; ComponentLink4Description: Datasheet; ComponentLink4URL: https://www.ti.com/lit/ds/symlink/bq34z100-g1.pdf?&ts=1589205881092; ComponentLink5Description: EVM Manual; ComponentLink5URL: http://www.ti.com/lit/ug/sluu904a/sluu904a.pdf?&ts=1589277756655; ComponentLink6Description: Tech Ref Manual; ComponentLink6URL: https://www.ti.com/lit/ug/sluubw5/sluubw5.pdf?&ts=1589205888955

## Sheet BMU_V50_CellBalancer.SchDoc
size C
Used 2 times, as channels StringA/U_BMU_V50_CellBalancer, StringB/U_BMU_V50_CellBalancer. Parts and nets are listed once, with the designators drawn on the sheet.
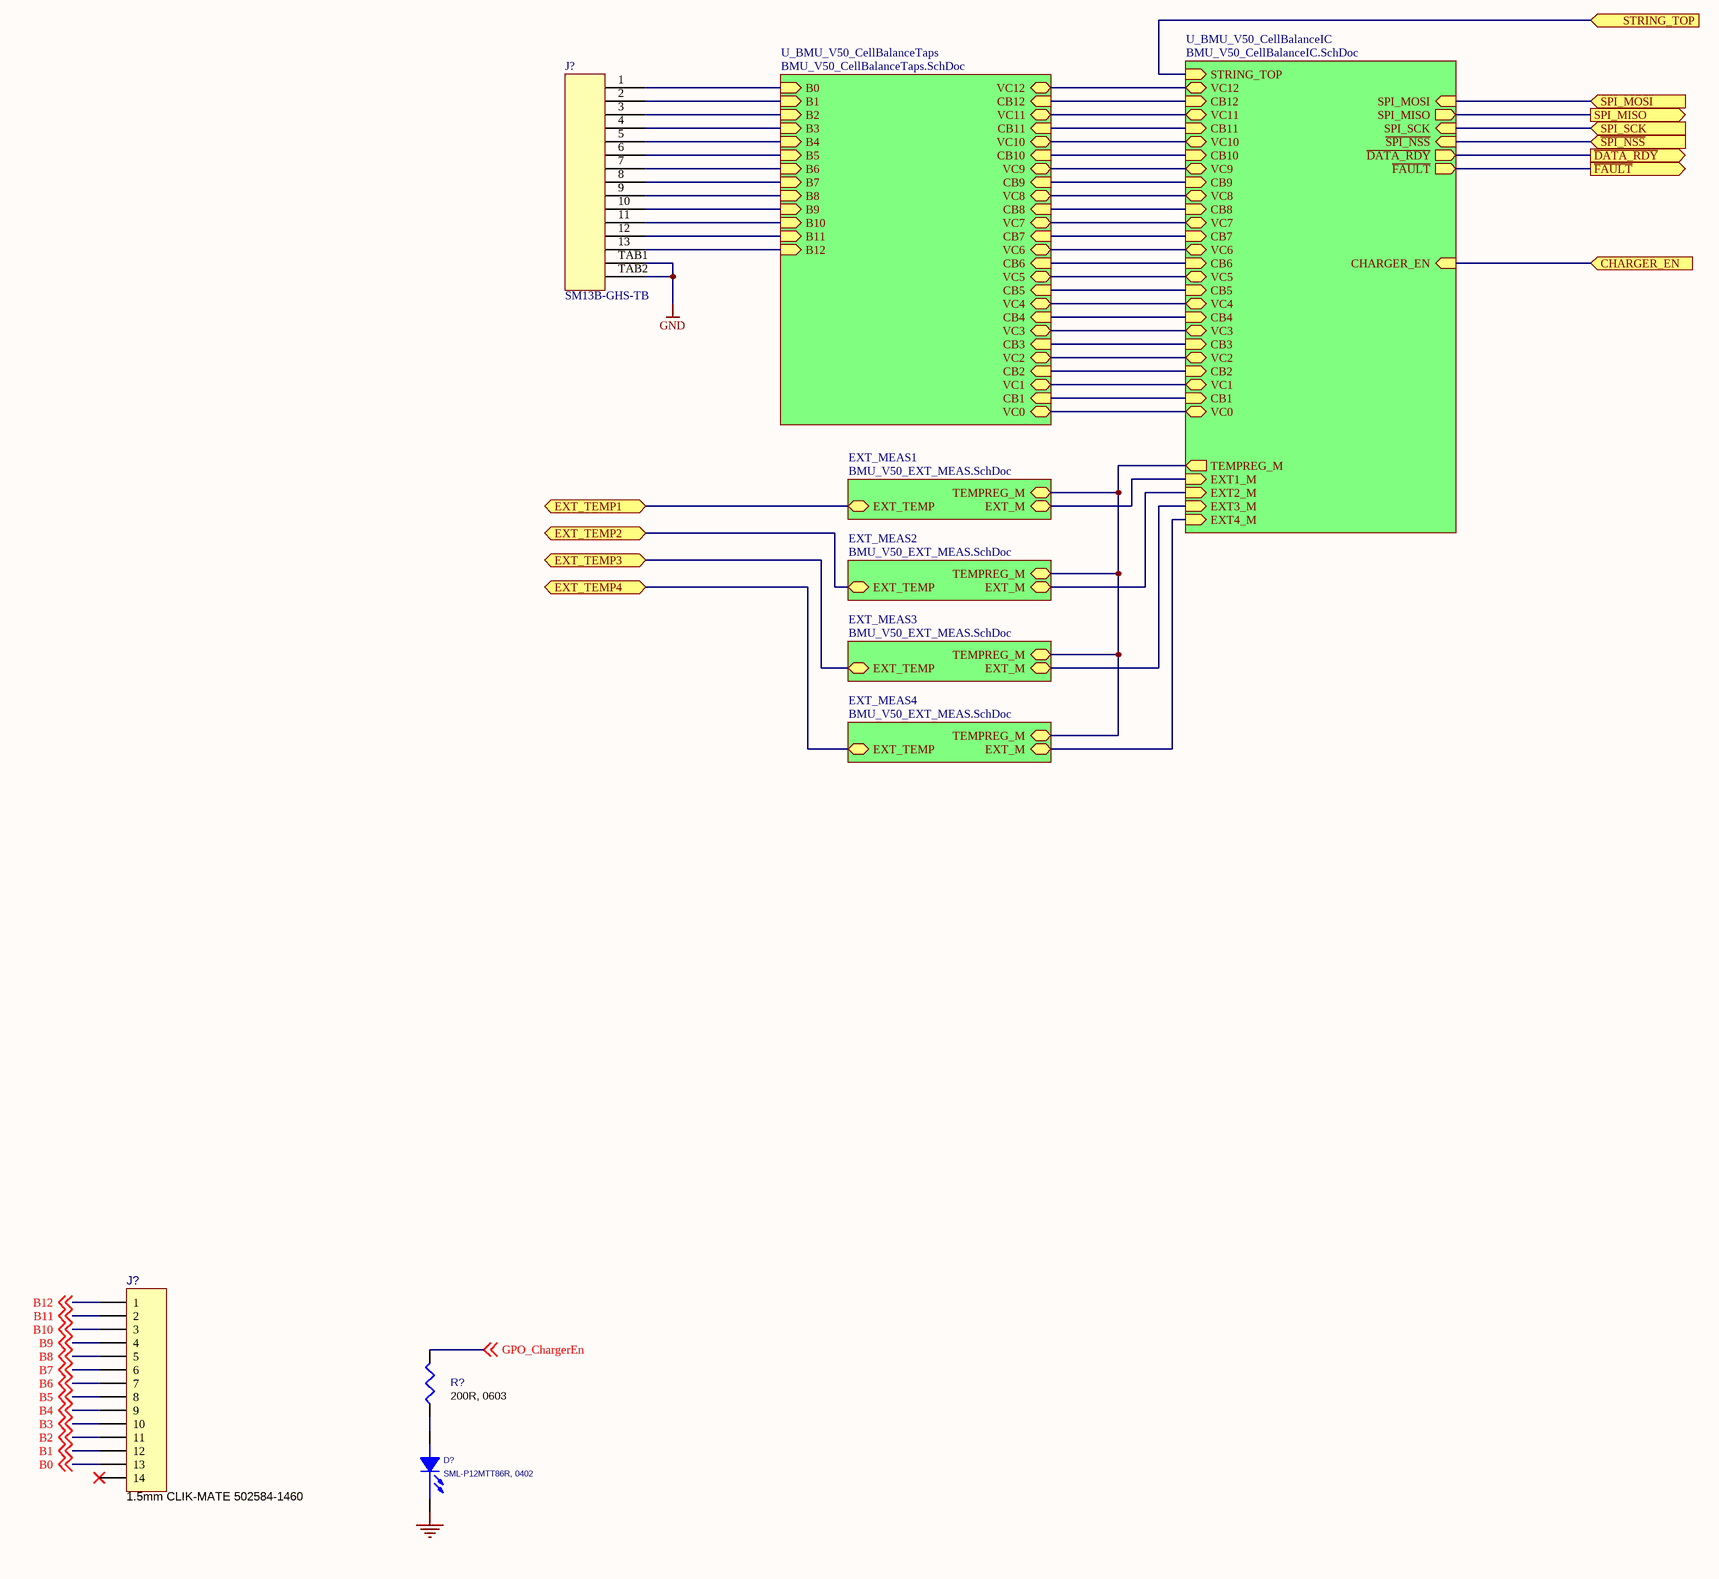
[diagram p4: BMU_V50_CellBalancer.SchDoc]

### Parts
(Parts that share a designator on the sheet are numbered #1, #2 ... from top to bottom, then left to right.)
D?  SML-P12MTT86R, 0402  [D0402]
J?#1  SM13B-GHS-TB  [SM13B-GHS-TB]
J?#2  1.5mm CLIK-MATE 502584-1460  [CONN14_1p5mm_SM]
R?  200R, 0603  [R0603]

### Sub-sheets
EXT_MEAS1 = BMU_V50_EXT_MEAS.SchDoc: EXT_M (bidir), EXT_TEMP (bidir), TEMPREG_M (bidir)
EXT_MEAS2 = BMU_V50_EXT_MEAS.SchDoc: EXT_M (bidir), EXT_TEMP (bidir), TEMPREG_M (bidir)
EXT_MEAS3 = BMU_V50_EXT_MEAS.SchDoc: EXT_M (bidir), EXT_TEMP (bidir), TEMPREG_M (bidir)
EXT_MEAS4 = BMU_V50_EXT_MEAS.SchDoc: EXT_M (bidir), EXT_TEMP (bidir), TEMPREG_M (bidir)
U_BMU_V50_CellBalanceIC = BMU_V50_CellBalanceIC.SchDoc: VC12 (bidir), CB12 (in), CB11 (in), VC11 (bidir), VC10 (bidir), CB10 (in), SPI_SCK (in), ~{FAULT} (out), EXT1_M (in), EXT3_M (in), EXT2_M (in), SPI_MOSI (in), ~{SPI_NSS} (in), CHARGER_EN (in), STRING_TOP (in), EXT4_M (in), ~{DATA_RDY} (out), SPI_MISO (out), VC9 (bidir), CB9 (in), VC8 (bidir), CB8 (in), VC7 (bidir), CB7 (in), VC6 (bidir), CB6 (in), VC5 (bidir), CB5 (in), VC4 (bidir), CB4 (in), VC3 (bidir), CB3 (in), VC2 (bidir), CB2 (in), VC1 (bidir), CB1 (in), VC0 (bidir), TEMPREG_M (out)
U_BMU_V50_CellBalanceTaps = BMU_V50_CellBalanceTaps.SchDoc: B11 (in), CB4 (in), B9 (in), VC6 (bidir), B2 (in), CB10 (in), B10 (in), CB5 (in), B12 (in), CB7 (in), B5 (in), B8 (in), VC5 (bidir), CB12 (in), VC0 (bidir), VC12 (bidir), VC8 (bidir), CB8 (in), VC2 (bidir), B0 (in), CB11 (in), B7 (in), VC7 (bidir), VC11 (bidir), B4 (in), B6 (in), VC9 (bidir), B1 (in), B3 (in), CB6 (in), VC1 (bidir), CB3 (in), CB9 (in), CB2 (in), VC10 (bidir), VC3 (bidir), CB1 (in), VC4 (bidir)

### Ports
CHARGER_EN (in), EXT_TEMP1 (bidir), EXT_TEMP2 (bidir), EXT_TEMP3 (bidir), EXT_TEMP4 (bidir), SPI_MISO (out), SPI_MOSI (in), SPI_SCK (in), STRING_TOP (in), ~{DATA_RDY} (out), ~{FAULT} (out), ~{SPI_NSS} (in)

### Nets
GND: D?.C(CATHODE) J?#1.TAB1 J?#1.TAB2
B0: J?#2.13 ; off-sheet B0
B1: J?#2.12 ; off-sheet B1
B2: J?#2.11 ; off-sheet B2
B3: J?#2.10 ; off-sheet B3
B4: J?#2.9 ; off-sheet B4
B5: J?#2.8 ; off-sheet B5
B6: J?#2.7 ; off-sheet B6
B7: J?#2.6 ; off-sheet B7
B8: J?#2.5 ; off-sheet B8
B9: J?#2.4 ; off-sheet B9
B10: J?#2.3 ; off-sheet B10
B11: J?#2.2 ; off-sheet B11
B12: J?#2.1 ; off-sheet B12
CHARGER_EN: port CHARGER_EN, sheet U_BMU_V50_CellBalanceIC/CHARGER_EN
~{DATA_RDY}: port ~{DATA_RDY}, sheet U_BMU_V50_CellBalanceIC/~{DATA_RDY}
EXT_TEMP1: port EXT_TEMP1, sheet EXT_MEAS1/EXT_TEMP
EXT_TEMP2: port EXT_TEMP2, sheet EXT_MEAS2/EXT_TEMP
EXT_TEMP3: port EXT_TEMP3, sheet EXT_MEAS3/EXT_TEMP
EXT_TEMP4: port EXT_TEMP4, sheet EXT_MEAS4/EXT_TEMP
~{FAULT}: port ~{FAULT}, sheet U_BMU_V50_CellBalanceIC/~{FAULT}
GPO_ChargerEn: R?.2 ; off-sheet GPO_ChargerEn
~{SPI_NSS}: port ~{SPI_NSS}, sheet U_BMU_V50_CellBalanceIC/~{SPI_NSS}
SPI_MISO: port SPI_MISO, sheet U_BMU_V50_CellBalanceIC/SPI_MISO
SPI_MOSI: port SPI_MOSI, sheet U_BMU_V50_CellBalanceIC/SPI_MOSI
SPI_SCK: port SPI_SCK, sheet U_BMU_V50_CellBalanceIC/SPI_SCK
STRING_TOP: port STRING_TOP, sheet U_BMU_V50_CellBalanceIC/STRING_TOP
NetD?_A: D?.A(ANODE) R?.1
NetJ?#1_1: J?#1.1 ; sheet U_BMU_V50_CellBalanceTaps/B0
NetJ?#1_2: J?#1.2 ; sheet U_BMU_V50_CellBalanceTaps/B1
NetJ?#1_3: J?#1.3 ; sheet U_BMU_V50_CellBalanceTaps/B2
NetJ?#1_4: J?#1.4 ; sheet U_BMU_V50_CellBalanceTaps/B3
NetJ?#1_5: J?#1.5 ; sheet U_BMU_V50_CellBalanceTaps/B4
NetJ?#1_6: J?#1.6 ; sheet U_BMU_V50_CellBalanceTaps/B5
NetJ?#1_7: J?#1.7 ; sheet U_BMU_V50_CellBalanceTaps/B6
NetJ?#1_8: J?#1.8 ; sheet U_BMU_V50_CellBalanceTaps/B7
NetJ?#1_9: J?#1.9 ; sheet U_BMU_V50_CellBalanceTaps/B8
NetJ?#1_10: J?#1.10 ; sheet U_BMU_V50_CellBalanceTaps/B9
NetJ?#1_11: J?#1.11 ; sheet U_BMU_V50_CellBalanceTaps/B10
NetJ?#1_12: J?#1.12 ; sheet U_BMU_V50_CellBalanceTaps/B11
NetJ?#1_13: J?#1.13 ; sheet U_BMU_V50_CellBalanceTaps/B12
(unnamed): sheet U_BMU_V50_CellBalanceTaps/CB4, sheet U_BMU_V50_CellBalanceIC/CB4
(unnamed): sheet U_BMU_V50_CellBalanceTaps/VC6, sheet U_BMU_V50_CellBalanceIC/VC6
(unnamed): sheet U_BMU_V50_CellBalanceTaps/CB10, sheet U_BMU_V50_CellBalanceIC/CB10
(unnamed): sheet U_BMU_V50_CellBalanceTaps/CB5, sheet U_BMU_V50_CellBalanceIC/CB5
(unnamed): sheet U_BMU_V50_CellBalanceTaps/CB7, sheet U_BMU_V50_CellBalanceIC/CB7
(unnamed): sheet U_BMU_V50_CellBalanceTaps/VC5, sheet U_BMU_V50_CellBalanceIC/VC5
(unnamed): sheet U_BMU_V50_CellBalanceTaps/CB12, sheet U_BMU_V50_CellBalanceIC/CB12
(unnamed): sheet U_BMU_V50_CellBalanceTaps/VC0, sheet U_BMU_V50_CellBalanceIC/VC0
(unnamed): sheet U_BMU_V50_CellBalanceTaps/VC12, sheet U_BMU_V50_CellBalanceIC/VC12
(unnamed): sheet U_BMU_V50_CellBalanceTaps/VC8, sheet U_BMU_V50_CellBalanceIC/VC8
(unnamed): sheet U_BMU_V50_CellBalanceTaps/CB8, sheet U_BMU_V50_CellBalanceIC/CB8
(unnamed): sheet U_BMU_V50_CellBalanceTaps/VC2, sheet U_BMU_V50_CellBalanceIC/VC2
(unnamed): sheet U_BMU_V50_CellBalanceTaps/CB11, sheet U_BMU_V50_CellBalanceIC/CB11
(unnamed): sheet U_BMU_V50_CellBalanceTaps/VC7, sheet U_BMU_V50_CellBalanceIC/VC7
(unnamed): sheet U_BMU_V50_CellBalanceTaps/VC11, sheet U_BMU_V50_CellBalanceIC/VC11
(unnamed): sheet U_BMU_V50_CellBalanceTaps/VC9, sheet U_BMU_V50_CellBalanceIC/VC9
(unnamed): sheet U_BMU_V50_CellBalanceTaps/CB6, sheet U_BMU_V50_CellBalanceIC/CB6
(unnamed): sheet U_BMU_V50_CellBalanceTaps/VC1, sheet U_BMU_V50_CellBalanceIC/VC1
(unnamed): sheet U_BMU_V50_CellBalanceTaps/CB3, sheet U_BMU_V50_CellBalanceIC/CB3
(unnamed): sheet U_BMU_V50_CellBalanceTaps/CB9, sheet U_BMU_V50_CellBalanceIC/CB9
(unnamed): sheet U_BMU_V50_CellBalanceTaps/CB2, sheet U_BMU_V50_CellBalanceIC/CB2
(unnamed): sheet U_BMU_V50_CellBalanceTaps/VC10, sheet U_BMU_V50_CellBalanceIC/VC10
(unnamed): sheet U_BMU_V50_CellBalanceTaps/VC3, sheet U_BMU_V50_CellBalanceIC/VC3
(unnamed): sheet U_BMU_V50_CellBalanceTaps/CB1, sheet U_BMU_V50_CellBalanceIC/CB1
(unnamed): sheet U_BMU_V50_CellBalanceTaps/VC4, sheet U_BMU_V50_CellBalanceIC/VC4
(unnamed): sheet U_BMU_V50_CellBalanceIC/EXT1_M, sheet EXT_MEAS1/EXT_M
(unnamed): sheet U_BMU_V50_CellBalanceIC/EXT3_M, sheet EXT_MEAS3/EXT_M
(unnamed): sheet U_BMU_V50_CellBalanceIC/EXT2_M, sheet EXT_MEAS2/EXT_M
(unnamed): sheet U_BMU_V50_CellBalanceIC/EXT4_M, sheet EXT_MEAS4/EXT_M
(unnamed): sheet U_BMU_V50_CellBalanceIC/TEMPREG_M, sheet EXT_MEAS1/TEMPREG_M, sheet EXT_MEAS2/TEMPREG_M, sheet EXT_MEAS3/TEMPREG_M, sheet EXT_MEAS4/TEMPREG_M

Not connected (* = marked no-connect by the designer): J?#2 14*

### Channels
StringA/U_BMU_V50_CellBalancer: designators D?=D?_StringA_U_BMU_V50_CellBalancer J?=J?_StringA_U_BMU_V50_CellBalancer#2 J?=J?_StringA_U_BMU_V50_CellBalancer#1 R?=R?_StringA_U_BMU_V50_CellBalancer; ports CHARGER_EN=NetU?#1_55 EXT_TEMP1=NetC?_StringA_U_BMU_V50_CellBalancer_EXT_MEAS1_1 EXT_TEMP2=NetC?_StringA_U_BMU_V50_CellBalancer_EXT_MEAS2_1 EXT_TEMP3=NetC?_StringA_U_BMU_V50_CellBalancer_EXT_MEAS3_1 EXT_TEMP4=NetC?_StringA_U_BMU_V50_CellBalancer_EXT_MEAS4_1 SPI_MISO=SPI_MISO SPI_MOSI=SPI_MOSI SPI_SCK=SPI_SCK STRING_TOP=NetC?_StringA_U_BMU_V50_StringPWRControl#1_1 ~{DATA_RDY}=NetU?#1_25 ~{FAULT}=NetD?#4_2 ~{SPI_NSS}=~{SPI_CS_BAL1}
StringB/U_BMU_V50_CellBalancer: designators D?=D?_StringB_U_BMU_V50_CellBalancer J?=J?_StringB_U_BMU_V50_CellBalancer#2 J?=J?_StringB_U_BMU_V50_CellBalancer#1 R?=R?_StringB_U_BMU_V50_CellBalancer; ports CHARGER_EN=NetU?#1_55 EXT_TEMP1=NetC?_StringB_U_BMU_V50_CellBalancer_EXT_MEAS1_1 EXT_TEMP2=NetC?_StringB_U_BMU_V50_CellBalancer_EXT_MEAS2_1 EXT_TEMP3=NetC?_StringB_U_BMU_V50_CellBalancer_EXT_MEAS3_1 EXT_TEMP4=NetC?_StringB_U_BMU_V50_CellBalancer_EXT_MEAS4_1 SPI_MISO=SPI_MISO SPI_MOSI=SPI_MOSI SPI_SCK=SPI_SCK STRING_TOP=NetC?_StringB_U_BMU_V50_StringPWRControl#1_1 ~{DATA_RDY}=NetU?#1_37 ~{FAULT}=NetD?#5_2 ~{SPI_NSS}=~{SPI_CS_BAL2}

### Notes on the sheet
- Title
- MATTERNET
- PROPRIETRY & CONFIDENTIAL
  THE INFORMATION CONTAINS IN THIS DRAWING
  IS THE SOLE PROPERTY OF  MATTERNET Inc.
  ANY REPRODUCTION IN PART OR AS WHOLE
  WITHOUT A WRITTEN PERMISSION OF
  MATTERNET Inc. IS PROHIBITED
- Size:
- Date:
- File:
- C
- Number:
- Time:
- Revision:
- Sheet
- of
- 161 E. Evelyn Ave.
- Mountain View,
- CA 94041 USA

### Library data of the parts
D? = LED-GENERIC: custinv: Ansync; custprt: 100-0500-000159; Option: AB
J?#1 = SM13B-GHS-TB: CONN HEADER GH SIDE 13POS 1.25MM; System: Connector; Supplier 1: Digi-Key; Supplier Part Number 1: 455-1575-1-ND
J?#2 = Header 14: CONN RCPT 14POS 0.059 TIN SMD; Manufacturer: Molex; Current Rating: 2A; Voltage Rating: 100V; Number of Positions: 14; Connector Type: Forked,Receptacle; Gender: Female; Glow Wire Compliant: Non-compliant; ComponentLink1URL: http://www.mouser.com/ds/2/276/5025841460_PCB_RECEPTACLES-179505.pdf; ComponentLink1Description: http://www.mouser.com/ds/2/276/5025841460_PCB_RECEPTACLES-179505.pdf; ComponentLink2URL: http://www.molex.com/pdm_docs/sd/5025841460_sd.pdf; ComponentLink2Description: http://www.molex.com/pdm_docs/sd/5025841460_sd.pdf; ComponentLink3URL: http://www.molex.com/webdocs/datasheets/pdf/en-us/5025841460_PCB_RECEPTACLES.pdf; ComponentLink3Description: http://www.molex.com/webdocs/datasheets/pdf/en-us/5025841460_PCB_RECEPTACLES.pdf; Supplier 1: Digikey; Supplier Part Number 1: WM20814CT-ND; Manufacturer Part Number: 502584-1460; Stock 1: 900; Pricing 1: 1=2.58, 10=2.341, 100=2.0064 (USD); Mount: Surface Mount; Color: Beige; Contact Plating: Tin; Contact Gender: Female; Package Quantity: 900; Number of Rows: 1; Packaging: Tape and Reel; Fastening Type: Latch; Termination: Solder; Number of Contacts: 14; Orientation: Vertical; Number of Circuits: 14; Pitch: 1.5mm; Radiation Hardening: No; REACH SVHC: No SVHC; Supplier 2: Mouser; Supplier Part Number 2: 538-502584-1460; Stock 2: 5330; Pricing 2: 1=1.96, 10=1.75, 50=1.75, 100=1.52, 1000=1.09, 10000=0.96 (USD); ComponentLink4URL: http://www.mouser.com/ds/2/276/5025841460_PCB_RECEPTACLES-179505.pdf?src-supplier=Mouser; ComponentLink4Description: http://www.mouser.com/ds/2/276/5025841460_PCB_RECEPTACLES-179505.pdf?src-supplier=Mouser; ComponentLink5URL: http://www.molex.com/pdm_docs/sd/5025841460_sd.pdf?src-supplier=Digi-Key; ComponentLink5Description: http://www.molex.com/pdm_docs/sd/5025841460_sd.pdf?src-supplier=Digi-Key; ComponentLink6URL: http://www.molex.com/webdocs/datasheets/pdf/en-us/5025841460_PCB_RECEPTACLES.pdf?src-supplier=Avnet; ComponentLink6Description: http://www.molex.com/webdocs/datasheets/pdf/en-us/5025841460_PCB_RECEPTACLES.pdf?src-supplier=Avnet
R? = R-Generic-0603: RES SMD 200 OHM 1% 1/10W 0603; Manufacturer: Yageo; Manufacturer Part Number: AC0603FR-07200RL; custprt: 100-0110-000074; custinv: Ansync; Option: AB; Max Power Dissipation: 100mW; Temperature Coefficient: 100ppm/°C; Supplier 1: Digi-Key; Supplier Part Number 1: YAG3576CT-ND; Stock 1: 46237; Pricing 1: 1=0.1, 10=0.032, 100=0.0129, 1000=0.00579, 2500=0.00502 (USD); Case/Package: 0603; Case Code (Metric): 1608; Case Code (Imperial): 0603; Min Operating Temperature: -55°C; Max Operating Temperature: 155°C; Packaging: Tape and Reel; Resistance: 200R; Composition: Thick Film; Number of Terminations: 2; Tolerance: 1%; Features: Automotive AEC-Q200,Moisture Resistant; Length: 0.063inch; Height: 0.022inch; Width: 0.031inch